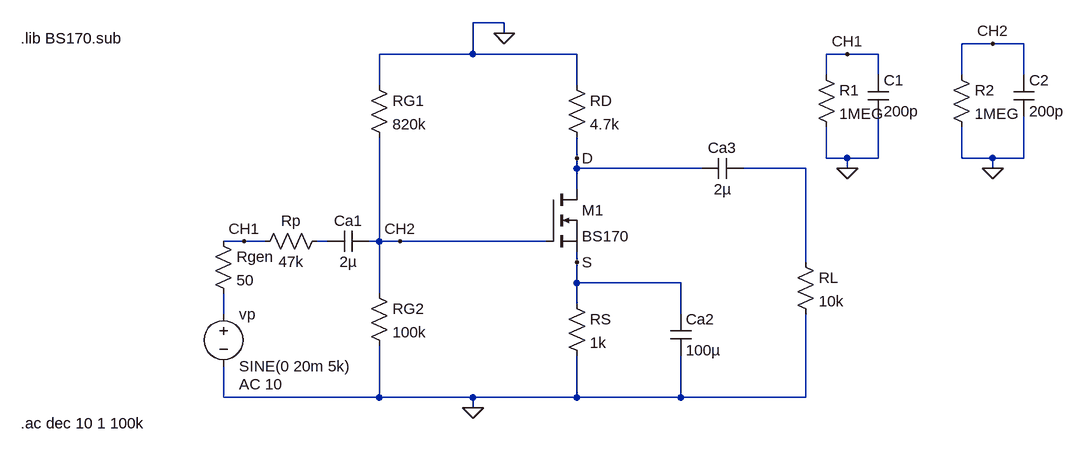
[diagram p0: schematic A.asc]
A.asc, the LTspice schematic file:
Version 4
SHEET 1 1732 680
WIRE 480 -48 432 -48
WIRE 480 -32 480 -48
WIRE 1232 -16 1184 -16
WIRE 1280 -16 1232 -16
WIRE 432 0 432 -48
WIRE 432 0 288 0
WIRE 592 0 432 0
WIRE 1008 0 976 0
WIRE 1056 0 1008 0
WIRE 976 32 976 0
WIRE 1056 32 1056 0
WIRE 1184 32 1184 -16
WIRE 1280 32 1280 -16
WIRE 288 48 288 0
WIRE 592 48 592 0
WIRE 592 160 592 128
WIRE 976 160 976 112
WIRE 1008 160 976 160
WIRE 1056 160 1056 96
WIRE 1056 160 1008 160
WIRE 1184 160 1184 112
WIRE 1232 160 1184 160
WIRE 1280 160 1280 96
WIRE 1280 160 1232 160
WIRE 592 176 592 160
WIRE 784 176 592 176
WIRE 944 176 848 176
WIRE 1008 176 1008 160
WIRE 1232 176 1232 160
WIRE 592 208 592 176
WIRE 80 288 48 288
WIRE 112 288 80 288
WIRE 208 288 192 288
WIRE 288 288 288 128
WIRE 288 288 272 288
WIRE 320 288 288 288
WIRE 544 288 320 288
WIRE 592 320 592 304
WIRE 944 320 944 176
WIRE 592 352 592 320
WIRE 752 352 592 352
WIRE 288 368 288 288
WIRE 592 384 592 352
WIRE 48 400 48 368
WIRE 752 400 752 352
WIRE 48 528 48 480
WIRE 288 528 288 448
WIRE 288 528 48 528
WIRE 432 528 288 528
WIRE 592 528 592 464
WIRE 592 528 432 528
WIRE 752 528 752 464
WIRE 752 528 592 528
WIRE 944 528 944 400
WIRE 944 528 752 528
WIRE 432 544 432 528
FLAG 432 544 0
FLAG 592 160 D
FLAG 592 320 S
FLAG 1008 176 0
FLAG 1232 176 0
FLAG 1008 0 CH1
FLAG 80 288 CH1
FLAG 1232 -16 CH2
FLAG 320 288 CH2
FLAG 480 -32 0
SYMBOL res 576 32 R0
SYMATTR InstName RD
SYMATTR Value 4.7k
SYMBOL res 272 32 R0
SYMATTR InstName RG1
SYMATTR Value 820k
SYMBOL res 272 352 R0
SYMATTR InstName RG2
SYMATTR Value 100k
SYMBOL res 576 368 R0
SYMATTR InstName RS
SYMATTR Value 1k
SYMBOL nmos 544 208 R0
SYMATTR InstName M1
SYMATTR Value BS170
SYMBOL cap 736 400 R0
SYMATTR InstName Ca2
SYMATTR Value 100µ
SYMBOL cap 848 160 R90
WINDOW 0 0 32 VBottom 2
WINDOW 3 32 32 VTop 2
SYMATTR InstName Ca3
SYMATTR Value 2µ
SYMBOL res 928 304 R0
SYMATTR InstName RL
SYMATTR Value 10k
SYMBOL res 32 272 R0
SYMATTR InstName Rgen
SYMATTR Value 50
SYMBOL voltage 48 384 R0
WINDOW 123 24 124 Left 2
WINDOW 39 0 0 Left 2
SYMATTR Value2 AC 10
SYMATTR InstName vp
SYMATTR Value SINE(0 20m 5k)
SYMBOL res 960 16 R0
SYMATTR InstName R1
SYMATTR Value 1MEG
SYMBOL cap 1040 32 R0
SYMATTR InstName C1
SYMATTR Value 200p
SYMBOL res 1168 16 R0
SYMATTR InstName R2
SYMATTR Value 1MEG
SYMBOL cap 1264 32 R0
SYMATTR InstName C2
SYMATTR Value 200p
SYMBOL res 208 272 R90
WINDOW 0 0 56 VBottom 2
WINDOW 3 32 56 VTop 2
SYMATTR InstName Rp
SYMATTR Value 47k
SYMBOL cap 272 272 R90
WINDOW 0 0 32 VBottom 2
WINDOW 3 32 32 VTop 2
SYMATTR InstName Ca1
SYMATTR Value 2µ
TEXT -264 -24 Left 2 !.lib BS170.sub
TEXT -264 568 Left 2 !.ac dec 10 1 100k

The netlist it stands for:
* A.asc
RD 0 D 4.7k
RG1 0 CH2 820k
RG2 CH2 0 100k
RS S 0 1k
M1 D CH2 S S BS170
Ca2 S 0 100µ
Ca3 N001 D 2µ
RL N001 0 10k
Rgen CH1 N003 50
vp N003 0 SINE(0 20m 5k) AC 10
R1 CH1 0 1MEG
C1 CH1 0 200p
R2 CH2 0 1MEG
C2 CH2 0 200p
Rp N002 CH1 47k
Ca1 CH2 N002 2µ
.model NMOS NMOS
.model PMOS PMOS
.lib standard.mos
.lib BS170.sub
.ac dec 10 1 100k
.backanno
.end

* Results of the author's LTspice run, read from the files saved beside the schematic
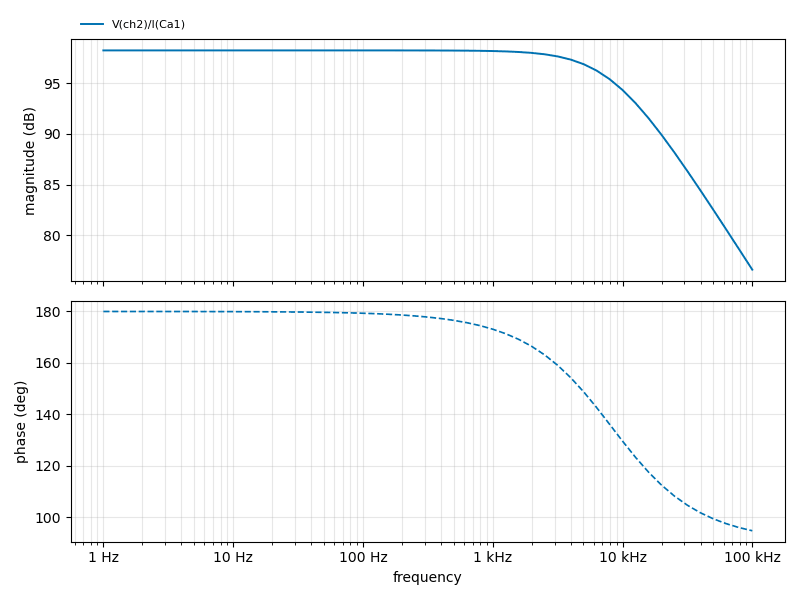
[diagram p1: AC Analysis of A.asc, plotted from the saved traces]
* AC Analysis, 1 run:
*   V(ch2)/I(Ca1): 98.26 dB at 1 Hz, 76.59 dB at 100 kHz, peak 98.26 dB at 1 Hz, 3 dB below the peak at 8.246 kHz